# EAGLE design mainboard (EAGLE 6.2)
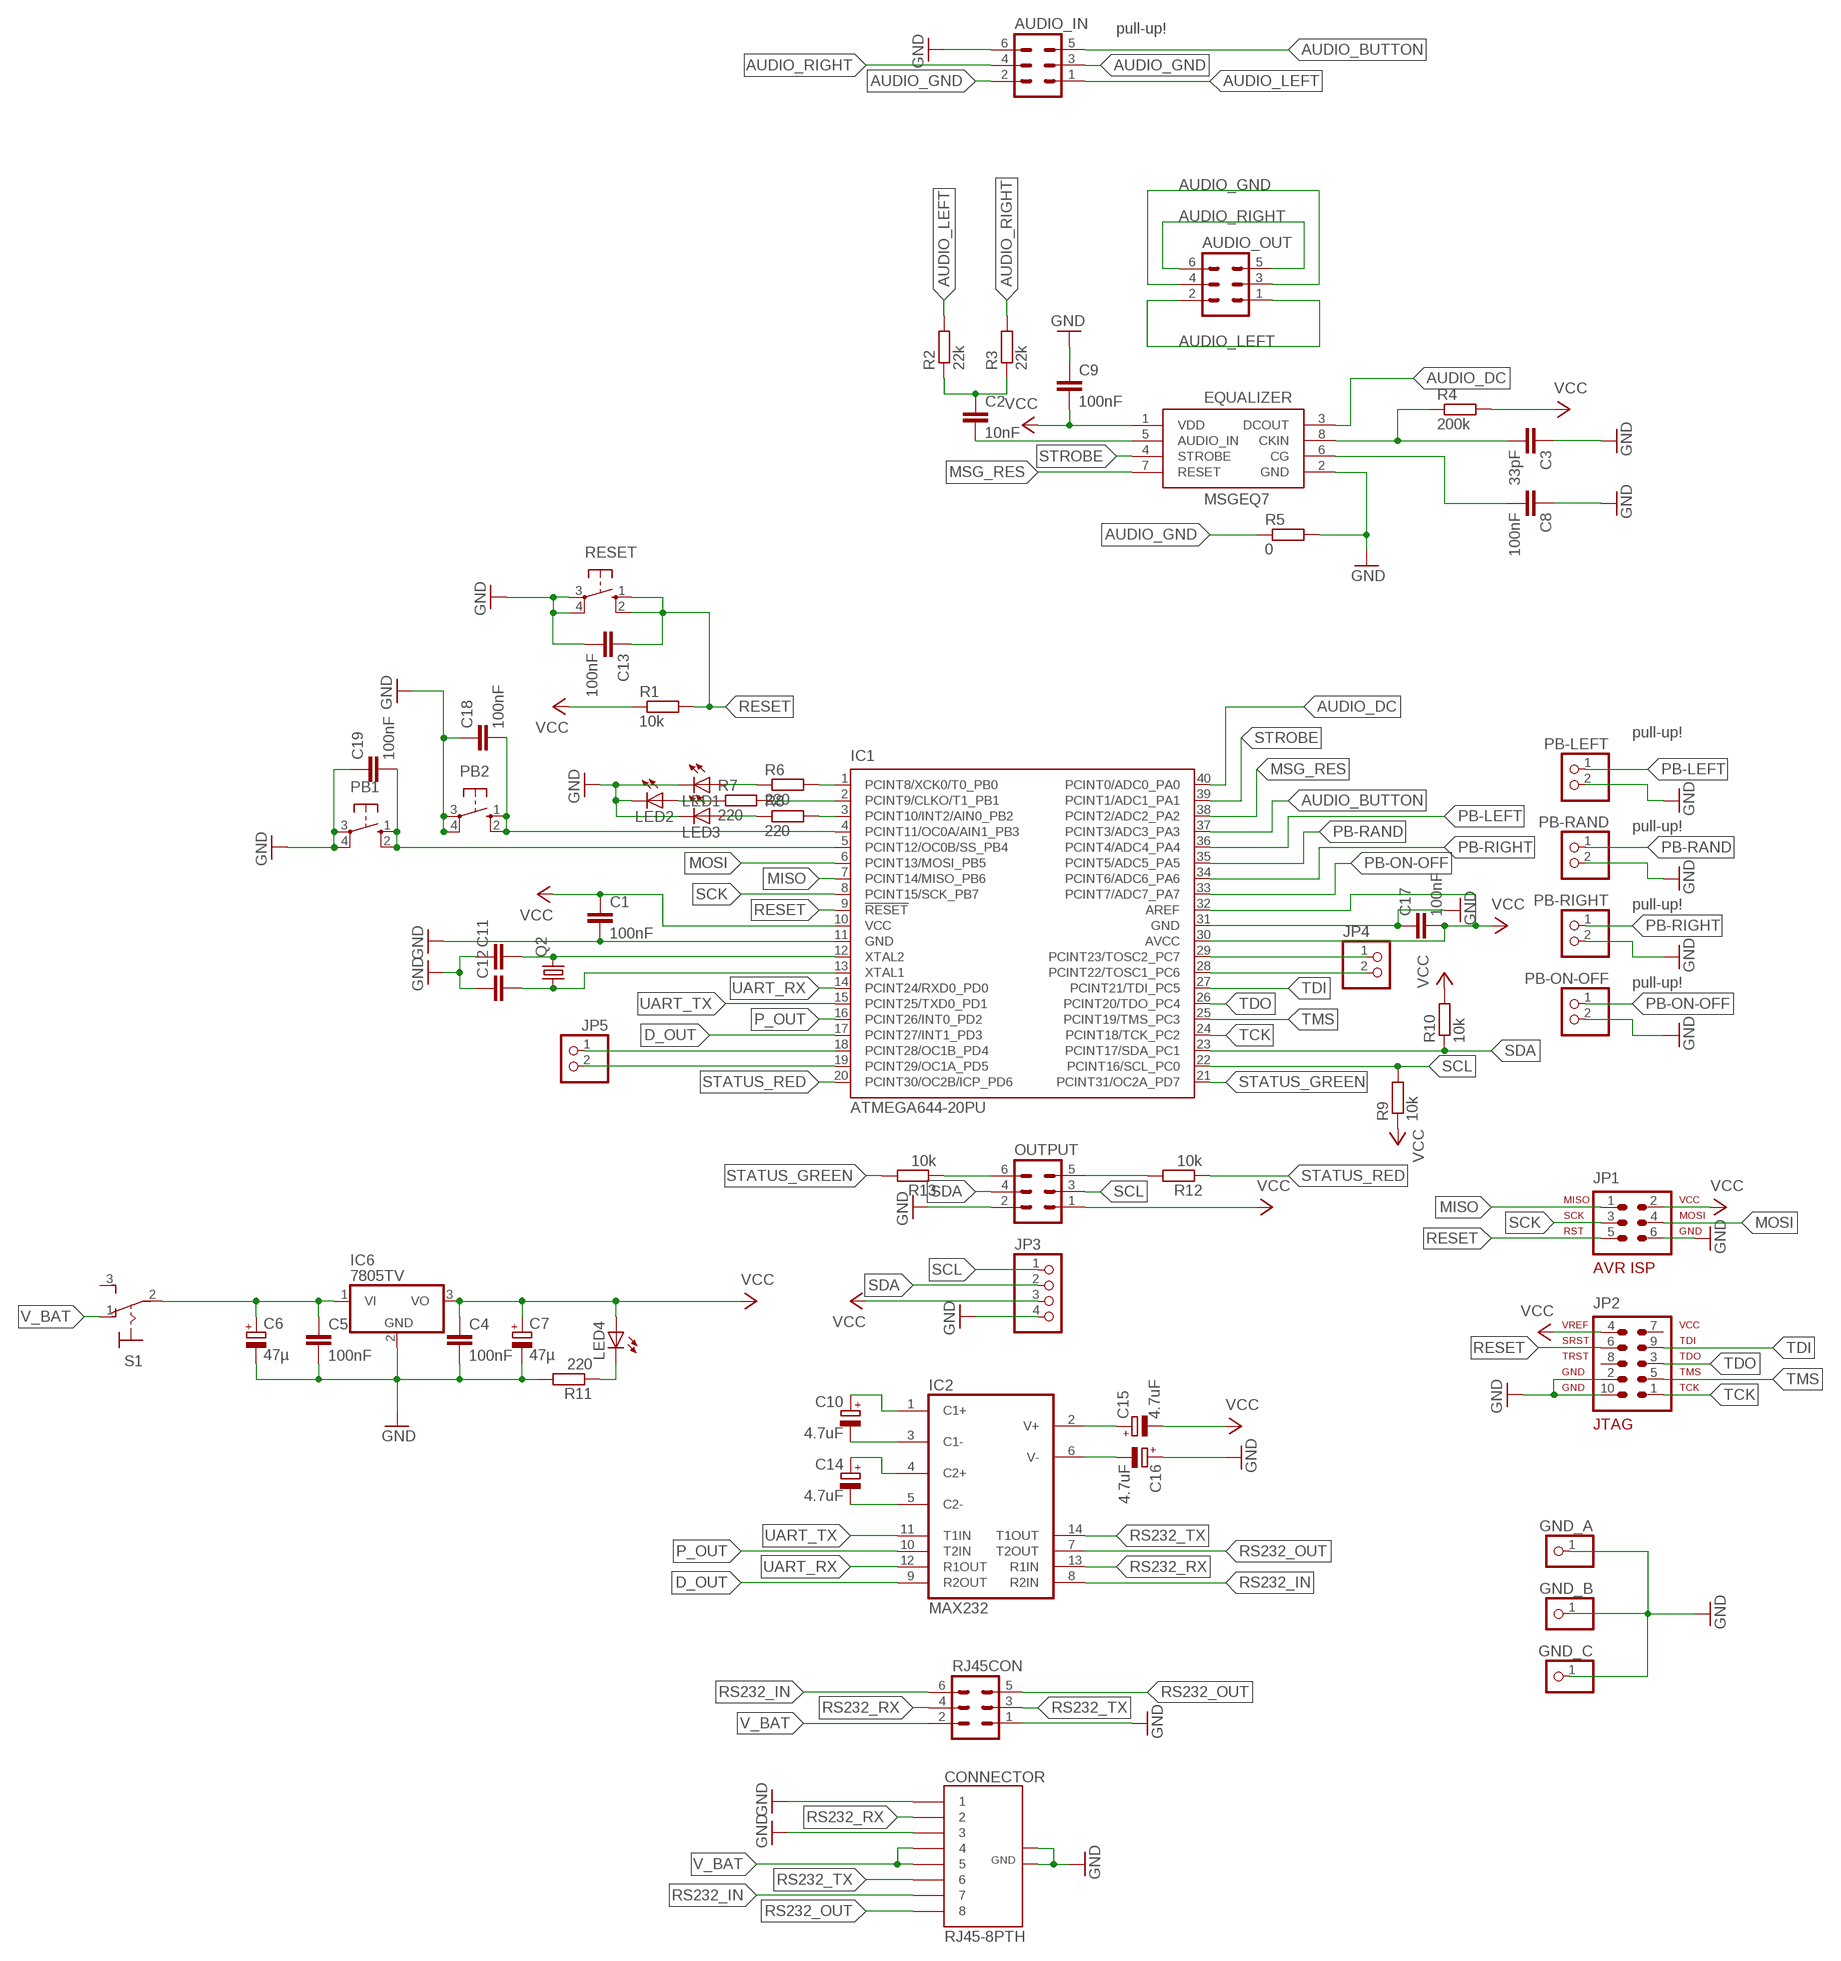
[diagram p0: schematic, sheet 1]

## Parts
AUDIO_IN  ML6  [ML6]
AUDIO_OUT  ML6  [ML6]
C1  100nF  C-EUC1206  [C1206]
C2  10nF  C-EUC1206  [C1206]
C3  33pF  C-EUC1206  [C1206]
C4  100nF  C-EUC1206  [C1206]
C5  100nF  C-EUC1206  [C1206]
C6  47µ  CPOL-EUE2.5-6  [E2,5-6]
C7  47µ  CPOL-EUE2.5-6  [E2,5-6]
C8  100nF  C-EUC1206  [C1206]
C9  100nF  C-EUC1206  [C1206]
C10  4.7uF  CPOL-EUE2-5  [E2-5]
C11  C-EUC1206  [C1206]
C12  C-EUC1206  [C1206]
C13  100nF  C-EUC1206  [C1206]
C14  4.7uF  CPOL-EUE2-5  [E2-5]
C15  4.7uF  CPOL-EUE2-5  [E2-5]
C16  4.7uF  CPOL-EUE2-5  [E2-5]
C17  100nF  C-EUC1206  [C1206]
C18  100nF  C-EUC1206  [C1206]
C19  100nF  C-EUC1206  [C1206]
CONNECTOR  RJ45-8PTH  [RJ45-8]
EQUALIZER  MSGEQ7  [DIL-08]
GND_A  PINHD-1X1  [1X01]
GND_B  PINHD-1X1  [1X01]
GND_C  PINHD-1X1  [1X01]
IC1  ATMEGA644-20PU  [DIL40]
IC2  MAX232  [DIL16]
IC6  7805TV  [TO220V]
JP1  AVR-ISP-6VERT  [AVR-ISP-6]
JP2  AVR-JTAG-10  [AVR-JTAG-10]
JP3  PINHD-1X4  [1X04]
JP4  PINHD-1X2  [1X02]
JP5  PINHD-1X2  [1X02]
LED1  LED5MM  [LED5MM]
LED2  LED5MM  [LED5MM]
LED3  LED5MM  [LED5MM]
LED4  LED5MM  [LED5MM]
OUTPUT  ML6  [ML6]
PB1  10-XX  [B3F-10XX]
PB2  10-XX  [B3F-10XX]
PB-LEFT  PINHD-1X2  [1X02]
PB-ON-OFF  PINHD-1X2  [1X02]
PB-RAND  PINHD-1X2  [1X02]
PB-RIGHT  PINHD-1X2  [1X02]
Q2  CRYSTALHC49S  [HC49/S]
R1  10k  R-EU_0207/10  [0207/10]
R2  22k  R-EU_0207/10  [0207/10]
R3  22k  R-EU_0207/10  [0207/10]
R4  200k  R-EU_0207/10  [0207/10]
R5  0  R-EU_M1206  [M1206]
R6  220  R-EU_0207/10  [0207/10]
R7  220  R-EU_0207/10  [0207/10]
R8  220  R-EU_0207/10  [0207/10]
R9  10k  R-EU_0207/10  [0207/10]
R10  10k  R-EU_0207/12  [0207/12]
R11  220  R-EU_0207/10  [0207/10]
R12  10k  R-EU_0207/15  [0207/15]
R13  10k  R-EU_0207/12  [0207/12]
RESET  10-XX  [B3F-10XX]
RJ45CON  ML6  [ML6]
S1  M9040P  [M9040P]

## Nets
AUDIO_BUTTON: AUDIO_IN.5 IC1.37(PCINT3/ADC3_PA3)
AUDIO_DC: EQUALIZER.3(DCOUT) IC1.40(PCINT0/ADC0_PA0)
AUDIO_GND: AUDIO_IN.2 AUDIO_IN.3 AUDIO_OUT.3 AUDIO_OUT.4 R5.1
AUDIO_LEFT: AUDIO_IN.1 AUDIO_OUT.1 AUDIO_OUT.2 R2.2
AUDIO_RIGHT: AUDIO_IN.4 AUDIO_OUT.5 AUDIO_OUT.6 R3.2
D_OUT: IC1.17(PCINT27/INT1_PD3) IC2.9(R2OUT)
FJKSABFJSD: C5.1 C6.+ IC6.1(VI) S1.2(P)
GND: AUDIO_IN.6 C1.2 C3.1 C4.2 C5.2 C6.- C7.- C8.1 C9.1 C11.1 C12.1 C13.2 C16.+ C17.1 C18.1 C19.1 CONNECTOR.1 CONNECTOR.3 CONNECTOR.GND_1 CONNECTOR.GND_2 EQUALIZER.2(GND) GND_A.1 GND_B.1 GND_C.1 IC1.11(GND) IC1.31(GND) IC6.2(GND) JP1.6 JP2.2 JP2.10 JP3.4 LED1.K(C) LED2.K(C) LED3.K(C) OUTPUT.2 PB1.3(P) PB1.4(P1) PB2.3(P) PB2.4(P1) PB-LEFT.2 PB-ON-OFF.2 PB-RAND.2 PB-RIGHT.2 R5.2 R11.2 RESET.3(P) RESET.4(P1) RJ45CON.1
MISO: IC1.7(PCINT14/MISO_PB6) JP1.1
MOSI: IC1.6(PCINT13/MOSI_PB5) JP1.4
MSG_RES: EQUALIZER.7(RESET) IC1.38(PCINT2/ADC2_PA2)
N$1: C2.2 EQUALIZER.5(AUDIO_IN)
N$2: C2.1 R2.1 R3.1
N$3: C3.2 EQUALIZER.8(CKIN) R4.1
N$4: C14.+ IC2.4(C2+)
N$5: C8.2 EQUALIZER.6(CG)
N$6: C14.- IC2.5(C2-)
N$7: C10.- IC2.3(C1-)
N$8: C10.+ IC2.1(C1+)
N$9: C16.- IC2.6(V-)
N$10: C15.+ IC2.2(V+)
N$11: LED1.A R6.1
N$12: IC1.1(PCINT8/XCK0/T0_PB0) R6.2
N$13: IC1.2(PCINT9/CLKO/T1_PB1) R7.2
N$14: LED2.A R7.1
N$15: IC1.3(PCINT10/INT2/AIN0_PB2) R8.2
N$16: C11.2 IC1.12(XTAL2) Q2.2
N$17: C12.2 IC1.13(XTAL1) Q2.1
N$18: LED3.A R8.1
N$19: LED4.K(C) R11.1
N$20: C18.2 IC1.4(PCINT11/OC0A/AIN1_PB3) PB2.1(S) PB2.2(S1)
N$21: IC1.28(PCINT22/TOSC1_PC6) JP4.2
N$22: IC1.29(PCINT23/TOSC2_PC7) JP4.1
N$23: OUTPUT.5 R12.2
N$24: C19.2 IC1.5(PCINT12/OC0B/SS_PB4) PB1.1(S) PB1.2(S1)
N$25: OUTPUT.6 R13.1
N$26: IC1.18(PCINT28/OC1B_PD4) JP5.1
N$27: IC1.19(PCINT29/OC1A_PD5) JP5.2
P_OUT: IC1.16(PCINT26/INT0_PD2) IC2.10(T2IN)
PB-LEFT: IC1.36(PCINT4/ADC4_PA4) PB-LEFT.1
PB-ON-OFF: IC1.33(PCINT7/ADC7_PA7) PB-ON-OFF.1
PB-RAND: IC1.35(PCINT5/ADC5_PA5) PB-RAND.1
PB-RIGHT: IC1.34(PCINT6/ADC6_PA6) PB-RIGHT.1
RESET: C13.1 IC1.9(!RESET) JP1.5 JP2.6 R1.2 RESET.1(S) RESET.2(S1)
RS232_IN: CONNECTOR.7 IC2.8(R2IN) RJ45CON.6
RS232_OUT: CONNECTOR.8 IC2.7(T2OUT) RJ45CON.5
RS232_RX: CONNECTOR.2 IC2.13(R1IN) RJ45CON.4
RS232_TX: CONNECTOR.6 IC2.14(T1OUT) RJ45CON.3
SCK: IC1.8(PCINT15/SCK_PB7) JP1.3
SCL: IC1.22(PCINT16/SCL_PC0) JP3.1 OUTPUT.3 R9.2
SDA: IC1.23(PCINT17/SDA_PC1) JP3.2 OUTPUT.4 R10.1
STATUS_GREEN: IC1.21(PCINT31/OC2A_PD7) R13.2
STATUS_RED: IC1.20(PCINT30/OC2B/ICP_PD6) R12.1
STROBE: EQUALIZER.4(STROBE) IC1.39(PCINT1/ADC1_PA1)
TCK: IC1.24(PCINT18/TCK_PC2) JP2.1
TDI: IC1.27(PCINT21/TDI_PC5) JP2.9
TDO: IC1.26(PCINT20/TDO_PC4) JP2.3
TMS: IC1.25(PCINT19/TMS_PC3) JP2.5
UART_RX: IC1.14(PCINT24/RXD0_PD0) IC2.12(R1OUT)
UART_TX: IC1.15(PCINT25/TXD0_PD1) IC2.11(T1IN)
V_BAT: CONNECTOR.4 CONNECTOR.5 RJ45CON.2 S1.1(O)
VCC: C1.1 C4.1 C7.+ C9.2 C15.- C17.2 EQUALIZER.1(VDD) IC1.10(VCC) IC1.30(AVCC) IC1.32(AREF) IC6.3(VO) JP1.2 JP2.4 JP3.3 LED4.A OUTPUT.1 R1.1 R4.2 R9.1 R10.2
Unconnected: JP2.7 JP2.8 S1.3(S)

## Notes on the sheet
- pull-up!
- pull-up!
- pull-up!
- pull-up!
- pull-up!

## Power pins joined to a net without a drawn wire
GND: IC2.15(GND)
VCC: IC2.16(VCC)

## Library data of the parts
AUDIO_IN AUDIO_OUT OUTPUT RJ45CON = con-ml:ML6: HARTING; OC_FARNELL: unknown; OC_NEWARK: unknown
C1-C5 C8 C9 C11-C13 C17-C19 = resistor:C-EU: CAPACITOR, European symbol
C6 C7 C10 C14-C16 = resistor:CPOL-EU: POLARIZED CAPACITOR, European symbol
CONNECTOR = ShortCircuitRobotics:RJ45-8: RJ45 Jack Simple RJ45, 8-pin connection - connector for common Cat5, Cat5e, and Cat6 Ethernet cables. Footprint not yet proven in production. Connector sku is PRT-00643; Breakout PCB sku is BOB-00716.
EQUALIZER = SparkFun:MSGEQ7
GND_A GND_B GND_C = pinhead:PINHD-1X1: PIN HEADER
IC1 = atmel:ATMEGA644-*PU: 8-bit Microcontroller with 64K Bytes In-System Programmable Flash Auto generated by make-symbol-device-package-bsdl.ulp Rev. 34 Source: http://www.atmel.com/dyn/resources/prod_documents/doc2593.pdf; MPN: ATMEGA644-20PU; OC_FARNELL: 1288340; OC_NEWARK: 23M5060
IC2 = maxim:MAX232: RS232 TRANSEIVER; MF: MAXIM; MPN: MAX232ACPE+; OC_FARNELL: 9723773; OC_NEWARK: 68K4544
IC6 = linear:78*: Positive VOLTAGE REGULATOR Source: http://cache.national.com/ds/LM/LM78L05.pdf http://www.fairchildsemi.com/ds/LM/LM7805.pdf
JP1 = avr-7:AVR-ISP-6: AVR ISP-6 Serial Programming Header
JP2 = avr-7:AVR-JTAG-10: AVR JTAG Debug/Programming Header
JP3 = pinhead:PINHD-1X4: PIN HEADER
JP4 JP5 PB-LEFT PB-ON-OFF PB-RAND PB-RIGHT = pinhead:PINHD-1X2: PIN HEADER
LED1-LED4 = led:LED: LED OSRAM: - CHIPLED LG R971, LG N971, LY N971, LG Q971, LY Q971, LO R971, LY R971 LH N974, LH R974 LS Q976, LO Q976, LY Q976 LO Q996 - Hyper CHIPLED LW Q18S LB Q993, LB Q99A, LB R99A - SideLED LS A670, LO A670, LY A670, LG A670, LP A670 LB A673, LV A673, LT A673, LW A673 LH A674 LY A675 LS A676, LA A676, LO A676, LY A676, LW A676 LS A679, LY A679, LG A679 - Hyper Micro SIDELED® LS Y876, LA Y876, LO Y876, LY Y876 LT Y87S - SmartLED LW L88C, LW L88S LB L89C, LB L89S, LG L890 LS L89K, LO L89K, LY L89K LS L896, LA L896, LO L896, LY L896 - TOPLED LS T670, LO T670, LY T670, LG T670, LP T670 LSG T670, LSP T670, LSY T670, LOP T670, LYG T670 LG T671, LOG T671, LSG T671 LB T673, LV T673, LT T673, LW T673 LH T674 LS T676, LA T676, LO T676, LY T676, LB T676, LH T676, LSB T676, LW T676 LB T67C, LV T67C, LT T67C, LS T67K, LO T67K, LY T67K, LW E67C LS E67B, LA E67B, LO E67B, LY E67B, LB E67C, LV E67C, LT E67C LW T67C LS T679, LY T679, LG T679 LS T770, LO T770, LY T770, LG T770, LP T770 LB T773, LV T773, LT T773, LW T773 LH T774 LS E675, LA E675, LY E675, LS T675 LS T776, LA T776, LO T776, LY T776, LB T776 LHGB T686 LT T68C, LB T68C - Hyper Mini TOPLED® LB M676 - Mini TOPLED Santana® LG M470 LS M47K, LO M47K, LY M47K Source: http://www.osram.convergy.de LUXEON: - LUMILED® LXK2-PW12-R00, LXK2-PW12-S00, LXK2-PW14-U00, LXK2-PW14-V00 LXK2-PM12-R00, LXK2-PM12-S00, LXK2-PM14-U00 LXK2-PE12-Q00, LXK2-PE12-R00, LXK2-PE12-S00, LXK2-PE14-T00, LXK2-PE14-U00 LXK2-PB12-K00, LXK2-PB12-L00, LXK2-PB12-M00, LXK2-PB14-N00, LXK2-PB14-P00, LXK2-PB14-Q00 LXK2-PR12-L00, LXK2-PR12-M00, LXK2-PR14-Q00, LXK2-PR14-R00 LXK2-PD12-Q00, LXK2-PD12-R00, LXK2-PD12-S00 LXK2-PH12-R00, LXK2-PH12-S00 LXK2-PL12-P00, LXK2-PL12-Q00, LXK2-PL12-R00 Source: www.luxeon.com KINGBRIGHT: KA-3528ASYC Source: www.kingbright.com
PB1 PB2 RESET = switch-omron:10-XX: OMRON SWITCH; MPN: B3F-1000; OC_FARNELL: 176432; OC_NEWARK: 36M3542
Q2 = crystal:CRYSTAL: CRYSTAL; OC_FARNELL: 1667008; OC_NEWARK: unknown
R1-R13 = resistor:R-EU_: RESISTOR, European symbol
S1 = switch:M9040P: TOGGLE SWITCH Marquardt

## Board
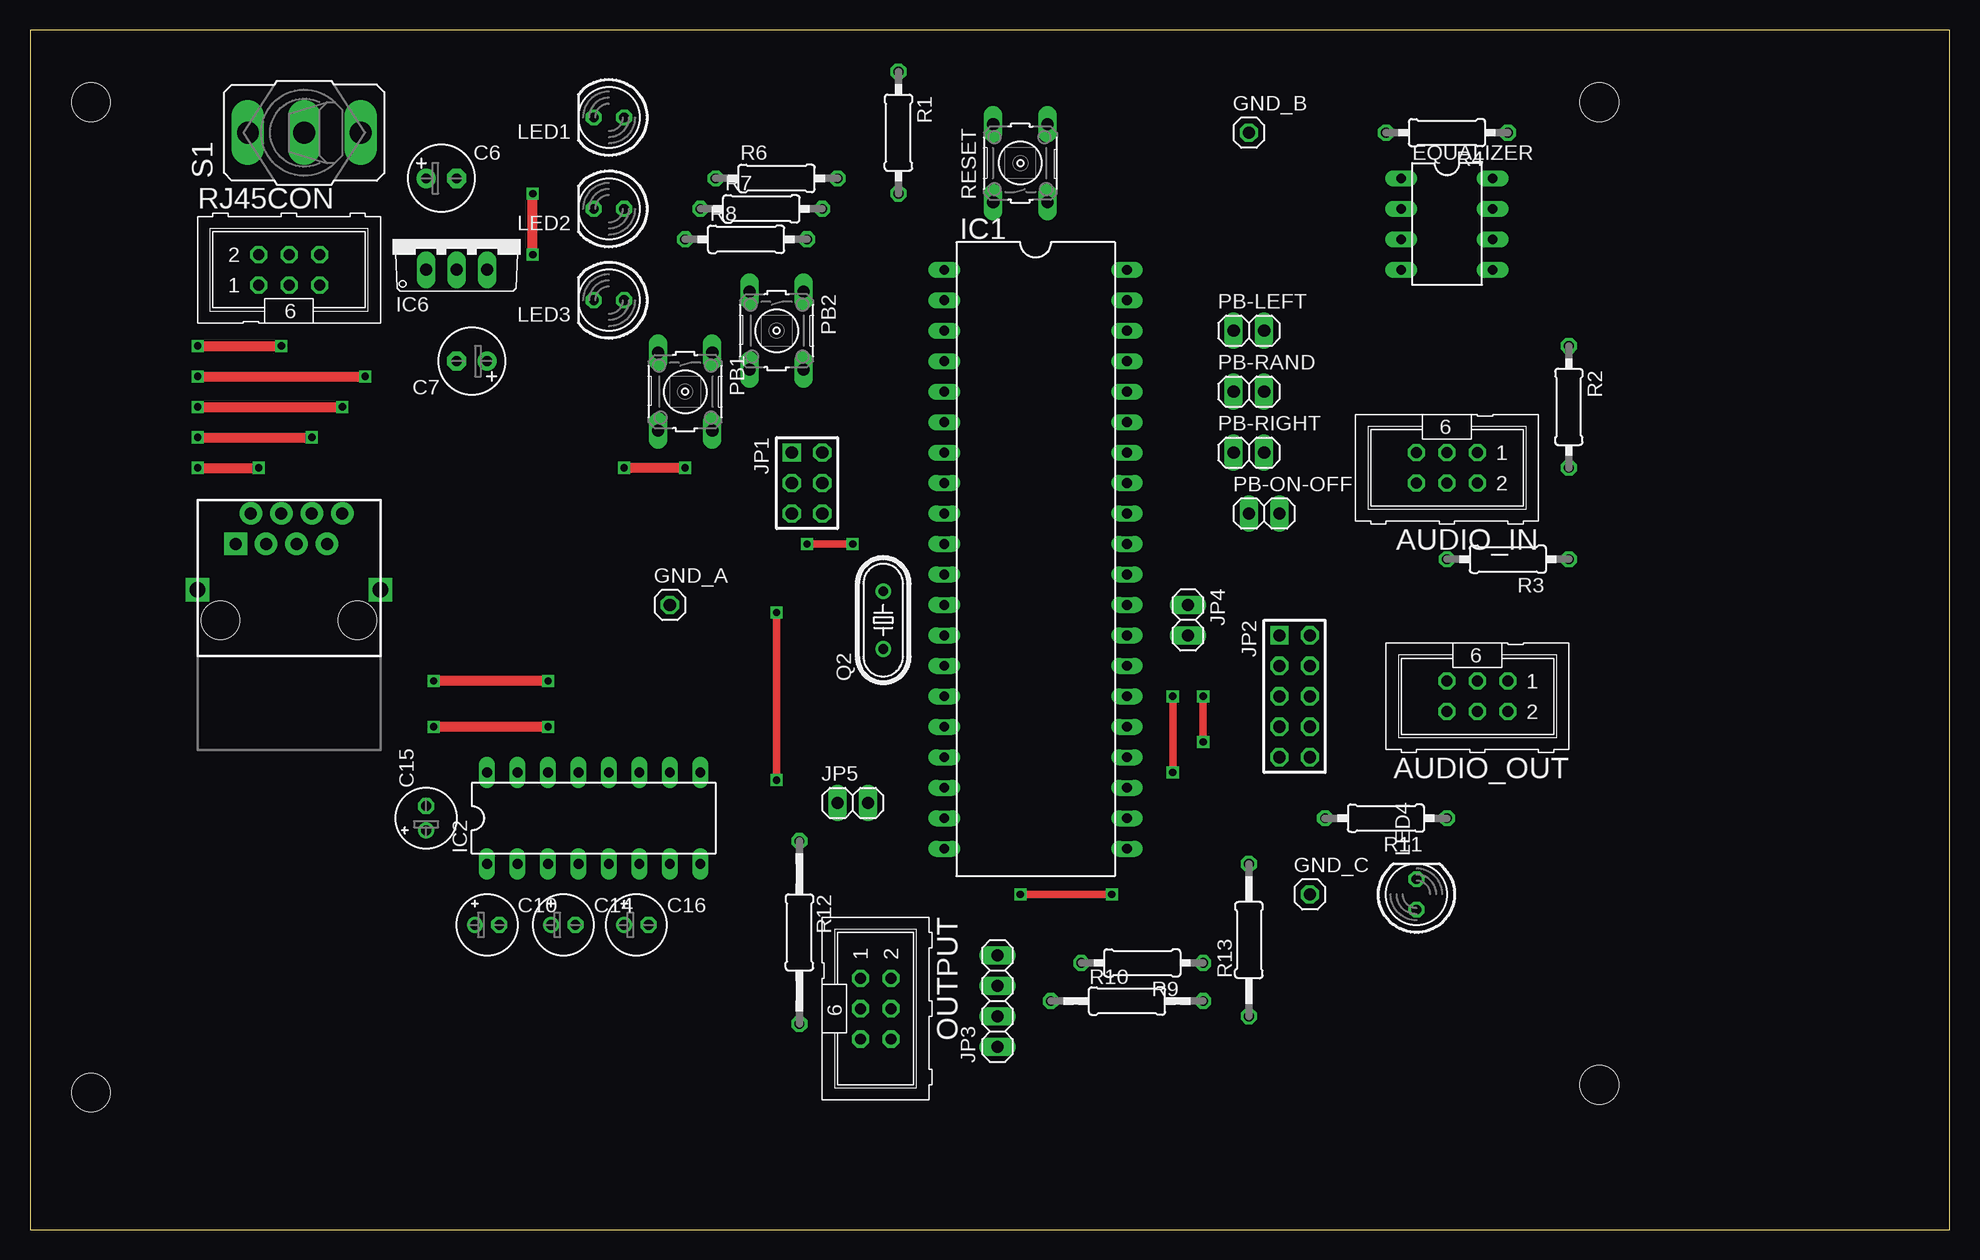
[diagram p1: board, top side]
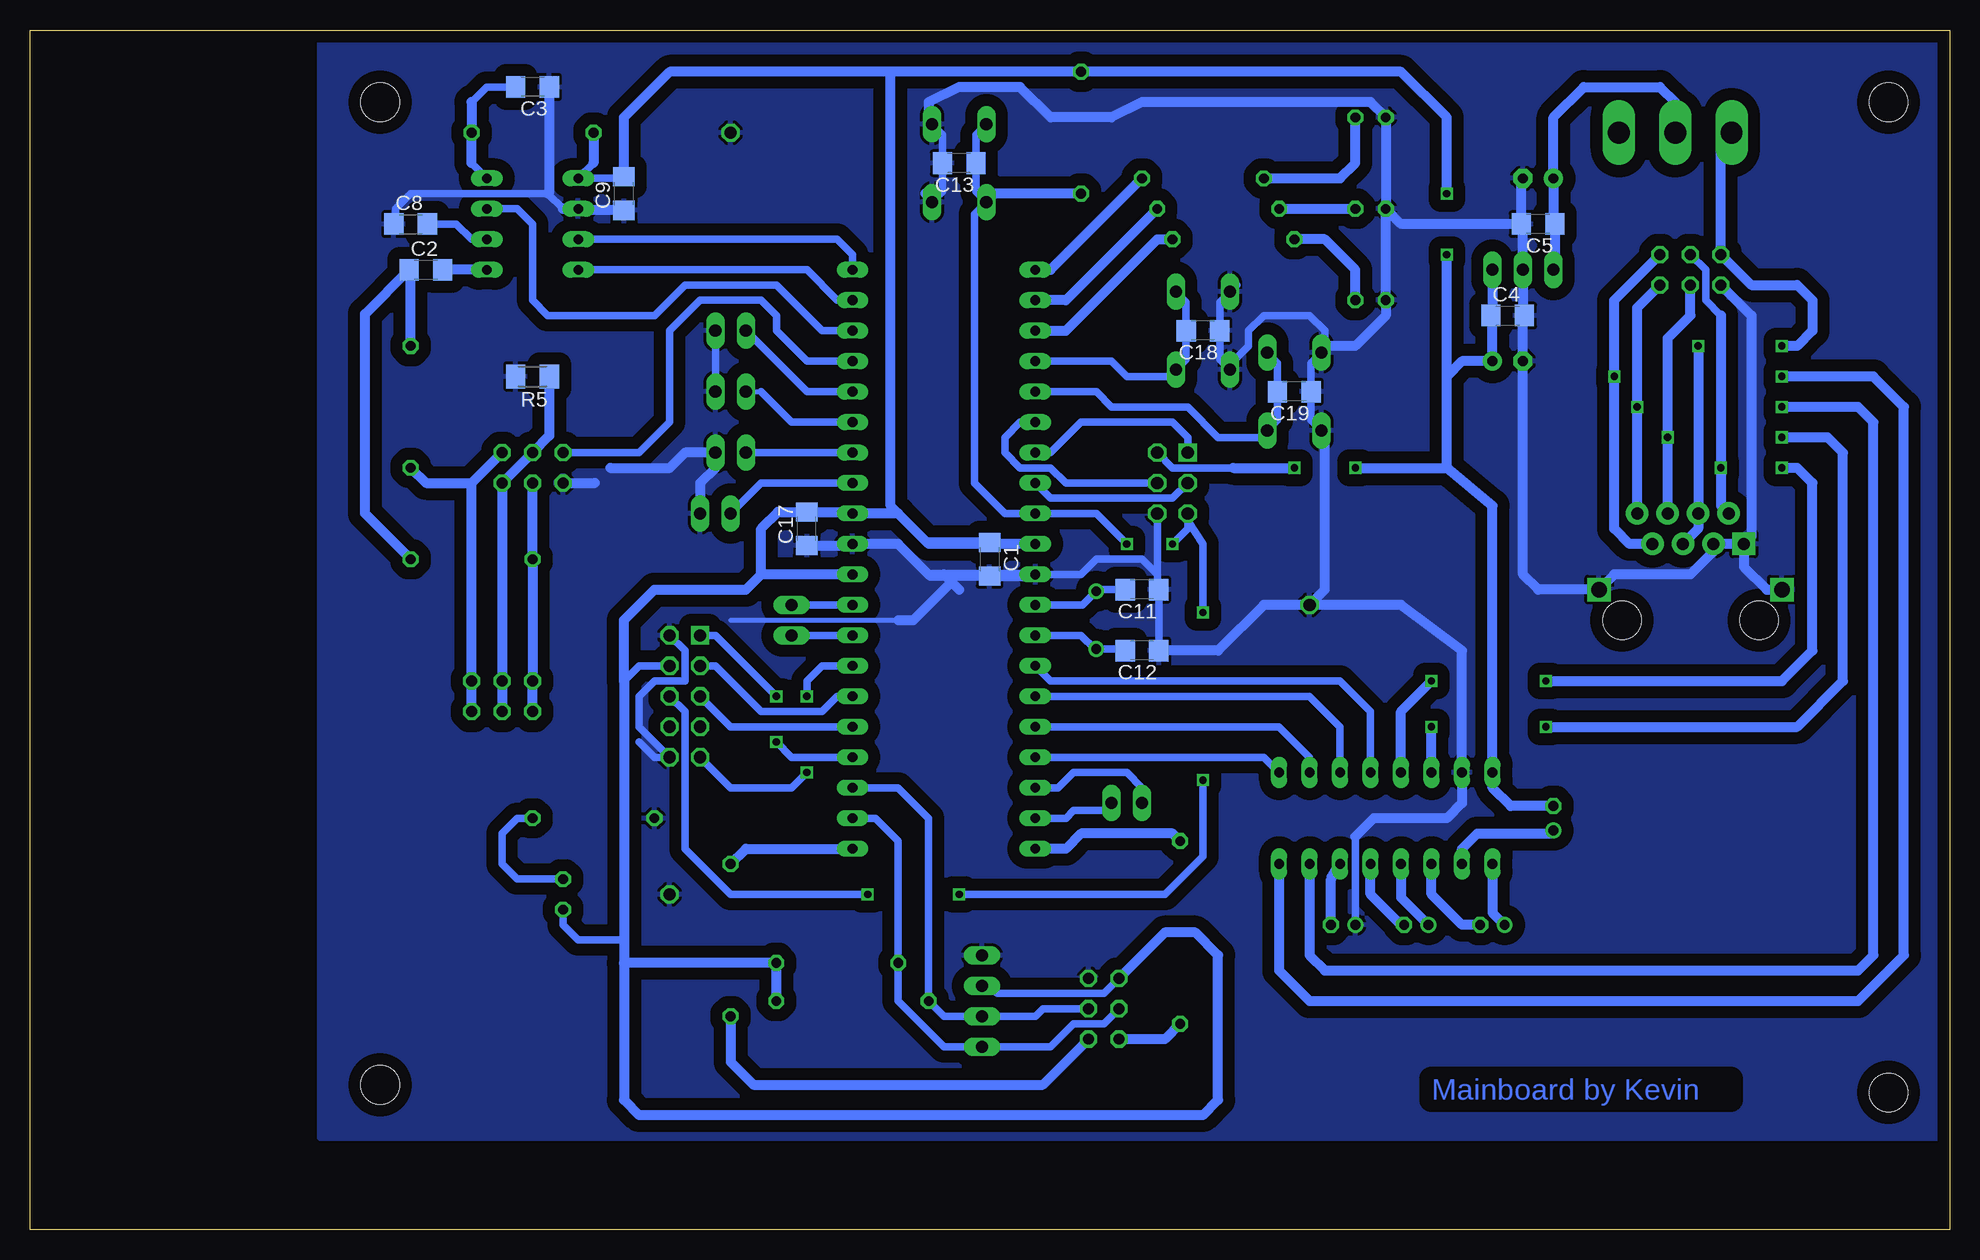
[diagram p2: board, bottom side, seen from below]

Size 160 x 100 mm. Coordinates in mm from the lower left corner, seen from the top.
Outline: 0,0 160,0 160,100 0,100 0,0
Copper layers (1*16): Top 0.035mm / dielectric 1.5mm / Bottom 0.035mm
Design rules: minimum track width 10mil, minimum drill 24mil, track to track 8mil, track to pad 8mil, pad to pad 8mil, via to via 8mil, smd to smd 8mil, copper to edge 40mil, drill to drill 8mil, minimum pad ring 10mil, minimum via ring 8mil, stop-mask expansion 4mil, vias tented up to drill 0mil, thermal gap 10mil
Holes 3.2 mm at 5.08,11.43 5.08,93.98 130.81,12.06 130.81,93.98

### Footprints (pad centres in the part's own frame; a part is rotated, then mirrored left to right if it is on the bottom)
ML6 = drill 0.914 octagon: 1 -2.54,-1.27; 2 -2.54,1.27; 3 0,-1.27; 4 0,1.27; 5 2.54,-1.27; 6 2.54,1.27
C1206 = smd 1.6 x 1.8: 1 -1.4,0; 2 1.4,0
E2,5-6 = drill 0.813 pad 1.6: + -1.27,0 | drill 0.813 pad 1.6 octagon: - 1.27,0
E2-5 = drill 0.813 pad 1.27: + -1.016,0 | drill 0.813 pad 1.27 octagon: - 1.016,0
RJ45-8 = drill 1 pad 1.88 square: 1 -4.445,6.35 | drill 1 pad 1.88: 2 -3.175,8.89; 3 -1.905,6.35; 4 -0.635,8.89; 5 0.635,6.35; 6 1.905,8.89; 7 3.175,6.35; 8 4.445,8.89 | drill 1.3 square: GND_1 -7.62,2.54; GND_2 7.62,2.54 | hole 3.2: -5.715,0; 5.715,0
DIL-08 = drill 0.813 long: 1 -3.81,-3.81; 2 -1.27,-3.81; 3 1.27,-3.81; 4 3.81,-3.81; 5 3.81,3.81; 6 1.27,3.81; 7 -1.27,3.81; 8 -3.81,3.81
1X01 = drill 1.016 octagon: 1 0,0
DIL40 = drill 0.813 long: 1 -24.13,-7.62; 2 -21.59,-7.62; 3 -19.05,-7.62; 4 -16.51,-7.62; 5 -13.97,-7.62; 6 -11.43,-7.62; 7 -8.89,-7.62; 8 -6.35,-7.62; 9 -3.81,-7.62; 10 -1.27,-7.62; 11 1.27,-7.62; 12 3.81,-7.62; 13 6.35,-7.62; 14 8.89,-7.62; 15 11.43,-7.62; 16 13.97,-7.62; 17 16.51,-7.62; 18 19.05,-7.62; 19 21.59,-7.62; 20 24.13,-7.62; 21 24.13,7.62; 22 21.59,7.62; 23 19.05,7.62; 24 16.51,7.62; 25 13.97,7.62; 26 11.43,7.62; 27 8.89,7.62; 28 6.35,7.62; 29 3.81,7.62; 30 1.27,7.62; 31 -1.27,7.62; 32 -3.81,7.62; 33 -6.35,7.62; 34 -8.89,7.62; 35 -11.43,7.62; 36 -13.97,7.62; 37 -16.51,7.62; 38 -19.05,7.62; 39 -21.59,7.62; 40 -24.13,7.62
DIL16 = drill 0.813 long: 1 -8.89,-3.81; 2 -6.35,-3.81; 3 -3.81,-3.81; 4 -1.27,-3.81; 5 1.27,-3.81; 6 3.81,-3.81; 7 6.35,-3.81; 8 8.89,-3.81; 9 8.89,3.81; 10 6.35,3.81; 11 3.81,3.81; 12 1.27,3.81; 13 -1.27,3.81; 14 -3.81,3.81; 15 -6.35,3.81; 16 -8.89,3.81
TO220V = drill 1.016 long: 1 -2.54,-2.54; 2 0,-2.54; 3 2.54,-2.54
AVR-ISP-6 = drill 1.016 square: 1 -2.54,-1.27 | drill 1.016 octagon: 2 -2.54,1.27; 3 0,-1.27; 4 0,1.27; 5 2.54,-1.27; 6 2.54,1.27
AVR-JTAG-10 = drill 1.016 square: 1 -5.08,-1.27 | drill 1.016 octagon: 2 -5.08,1.27; 3 -2.54,-1.27; 4 -2.54,1.27; 5 0,-1.27; 6 0,1.27; 7 2.54,-1.27; 8 2.54,1.27; 9 5.08,-1.27; 10 5.08,1.27
1X04 = drill 1.016 long: 1 -3.81,0; 2 -1.27,0; 3 1.27,0; 4 3.81,0
1X02 = drill 1.016 long: 1 -1.27,0; 2 1.27,0
LED5MM = drill 0.813 octagon: A -1.27,0; K 1.27,0
B3F-10XX = drill 1.016 long: 1 -3.251,2.261; 2 3.251,2.261; 3 -3.251,-2.261; 4 3.251,-2.261
HC49/S = drill 0.813: 1 -2.413,0; 2 2.413,0
0207/10 = drill 0.813 octagon: 1 -5.08,0; 2 5.08,0
M1206 = smd 1.6 x 2: 1 -1.4,0; 2 1.4,0
0207/12 = drill 0.813 octagon: 1 -6.35,0; 2 6.35,0
0207/15 = drill 0.813 octagon: 1 -7.62,0; 2 7.62,0
M9040P = drill 1.803 long: 1 0,4.699; 2 0,0; 3 0,-4.699

### Placement (x,y rotation side)
AUDIO_IN  118.11,63.5 180 top
AUDIO_OUT  120.65,44.45 180 top
C1  80.01,55.88 270 bottom
C2  127,80.01 0 bottom
C3  118.11,95.25 180 bottom
C4  36.83,76.2 0 bottom
C5  34.29,83.82 180 bottom
C6  34.29,87.63 0 top
C7  36.83,72.39 180 top
C8  128.27,83.82 0 bottom
C9  110.49,86.36 90 bottom
C10  38.1,25.4 0 top
C11  67.31,53.34 180 bottom
C12  67.31,48.26 180 bottom
C13  82.55,88.9 180 bottom
C14  44.45,25.4 0 top
C15  33.02,34.29 90 top
C16  50.55,25.4 0 top
C17  95.25,58.42 90 bottom
C18  62.23,74.93 180 bottom
C19  54.61,69.85 180 bottom
CONNECTOR  21.59,50.8 0 top
EQUALIZER  118.11,83.82 270 top
GND_A  53.34,52.07 0 top
GND_B  101.6,91.44 0 top
GND_C  106.68,27.94 0 top
IC1  83.82,55.88 270 top
IC2  46.99,34.29 0 top
IC6  35.56,82.55 0 top
JP1  64.77,62.23 270 top
JP2  105.41,44.45 270 top
JP3  80.64,19.05 90 top
JP4  96.52,50.8 270 top
JP5  68.58,35.56 0 top
LED1  48.26,92.71 180 top
LED2  48.26,85.09 180 top
LED3  48.26,77.47 180 top
LED4  115.57,27.94 90 top
OUTPUT  70.48,18.41 270 top
PB1  54.61,69.85 270 top
PB2  62.23,74.93 270 top
PB-LEFT  101.6,74.93 0 top
PB-ON-OFF  102.87,59.69 0 top
PB-RAND  101.6,69.85 0 top
PB-RIGHT  101.6,64.77 0 top
Q2  71.12,50.8 90 top
R1  72.39,91.44 270 top
R2  128.27,68.58 270 top
R3  123.19,55.88 180 top
R4  118.11,91.44 180 top
R5  118.11,71.12 180 bottom
R6  62.23,87.63 0 top
R7  60.96,85.09 0 top
R8  59.69,82.55 0 top
R9  92.71,22.23 180 top
R10  91.44,19.05 0 top
R11  113.03,34.29 180 top
R12  64.14,24.77 270 top
R13  101.6,24.13 90 top
RESET  82.55,88.9 90 top
RJ45CON  21.59,80.01 0 top
S1  22.86,91.44 90 top

### Tracks (layer width: path | path; a pad name or v marks a point on that pad's centre or on a via)
AUDIO_BUTTON
  Bottom 0.61: IC1.37 95.25,72.39 97.79,74.93 97.79,76.2 99.06,77.47 104.14,77.47 106.68,74.93 106.68,67.31 109.22,64.77 AUDIO_IN.5
AUDIO_DC
  Bottom 0.61: IC1.40 91.44,81.28 92.71,82.55 EQUALIZER.3
AUDIO_GND
  Bottom 0.61: AUDIO_OUT.4 AUDIO_OUT.3
  Bottom 0.813: AUDIO_OUT.4 AUDIO_IN.2 AUDIO_IN.3 116.71,66.17 R5.1
AUDIO_LEFT
  Bottom 0.61: AUDIO_OUT.1 AUDIO_OUT.2
  Bottom 0.813: AUDIO_OUT.2 123.19,62.23 | 123.19,62.23 AUDIO_IN.1 | R2.2 127,62.23 123.19,62.23
AUDIO_RIGHT
  Bottom 0.813: AUDIO_OUT.6 AUDIO_OUT.5 R3.2 AUDIO_IN.4
D_OUT
  Bottom 0.61: IC1.17 57.15,39.37 IC2.9
FJKSABFJSD
  Bottom 0.813: IC6.1 32.89,80.14 C5.1 33.02,83.82 C6.+ 33.02,92.71 30.48,95.25 24.13,95.25 22.86,93.98 S1.2
GND
  Bottom 0.406: 91.44,57.02 IC1.31 | 101.6,50.8 87.63,50.8 | 66.04,54.61 66.04,48.26 60.96,48.26
  Bottom 0.61: JP1.6 66.04,54.61 | 66.04,54.61 66.04,53.47 C11.1 C12.1 | 66.04,54.61 67.31,55.88 71.12,55.88 72.39,54.61 IC1.11 76.33,54.48 | PB-LEFT.2 PB-RAND.2 | 114.17,84.96 EQUALIZER.2 | 115.57,85.09 116.84,86.36 128.27,86.36 129.54,85.09 129.54,83.82 C8.1 | PB1.4 53.21,67.46 C19.1 53.21,72.24 PB1.3 52.07,73.38 52.07,74.93 53.34,76.2 57.15,76.2 58.42,74.93 58.42,73.66 59.97,72.11 PB2.4 60.83,72.54 C18.1 60.83,77.32 PB2.3 59.41,78.74 | RESET.4 83.95,91.29 C13.2 83.95,86.51 RESET.3 | C16.+ 49.53,32.77 | JP2.2 105.41,48.26 105.41,45.72 107.95,45.72 109.22,44.45 109.22,41.91 JP2.10 107.95,39.37 109.22,40.64
  Bottom 0.813: 76.33,54.48 C1.2 84.96,54.48 85.09,54.61 | IC1.31 87.63,57.15 85.09,54.61 | C17.1 91.44,57.02 | 82.55,53.34 83.19,53.98 | 83.19,53.98 83.82,54.61 | C9.1 114.17,84.96 | AUDIO_IN.6 112.9,62.23 | EQUALIZER.2 115.57,85.09 | 87.63,50.8 86.36,50.8 83.19,53.98 | 85.09,54.61 83.82,54.61 | 85.37,86.36 RESET.3 | C3.1 116.71,86.49 116.84,86.36 | LED2.K LED1.K 48.26,93.98 67.31,93.98 69.85,92.71 74.93,92.71 77.47,95.25 82.55,95.25 85.09,93.98 85.09,92.43 RESET.4 | PB1.3 51.79,73.66 49.53,73.66 46.99,76.2 LED3.K LED2.K | PB-ON-OFF.2 104.14,62.23 102.87,63.5 PB-RIGHT.2 105.41,64.77 106.68,63.5 111.63,63.5 | 49.53,32.77 48.01,34.29 41.91,34.29 40.64,35.56 IC2.15 40.64,48.26 45.72,52.07 GND_A.1 | RJ45CON.1 16.51,76.2 16.51,57.78 CONNECTOR.1 | GND_A.1 57.15,52.07 60.96,48.26 C12.1 66.04,48.26 | C5.2 35.69,87.5 C6.- | C5.2 35.56,83.69 IC6.2 35.56,76.33 C4.2 35.56,76.07 C7.- 35.56,54.61 34.29,53.34 CONNECTOR.GND_2 27.94,54.61 21.59,54.61 19.68,56.52 CONNECTOR.3 CONNECTOR.1 | C5.2 45.72,83.82 LED2.K | CONNECTOR.1 17.14,55.24 15.24,53.34 CONNECTOR.GND_1 | 83.82,54.61 IC1.11 | GND_A.1 52.07,53.34 52.07,66.32 PB1.4
  pour Bottom (isolate 1.016): 0,100.33 135.89,100.33 135.89,7.62 0,7.62
MISO
  Bottom 0.61: JP1.1 63.5,66.04 64.77,67.31 72.39,67.31 74.93,64.77 IC1.7
MOSI
  Bottom 0.61: IC1.6 77.47,67.31 78.74,66.04 78.74,64.77 77.47,63.5 74.93,63.5 73.66,62.23 JP1.4
MSG_RES
  Bottom 0.61: IC1.38 93.98,74.93 97.79,78.74 105.41,78.74 107.95,76.2 116.84,76.2 118.11,77.47 118.11,83.82 119.38,85.09 EQUALIZER.7
N$1
  Bottom 0.813: EQUALIZER.5 C2.2
N$2
  Bottom 0.813: R3.1 132.08,59.69 132.08,76.33 C2.1 128.27,79.88 R2.1
N$3
  Bottom 0.61: EQUALIZER.8 123.19,88.9 | 123.19,93.98 121.92,95.25 C3.2 119.38,95.25
  Bottom 0.813: 123.19,88.9 R4.1 123.19,93.98
N$4
  Bottom 0.813: IC2.4 45.72,27.69 C14.+
N$5
  Bottom 0.61: EQUALIZER.6 123.19,82.55 124.46,83.82 C8.2
N$6
  Bottom 0.813: C14.- 45.72,25.4 48.26,27.94 IC2.5
N$7
  Bottom 0.813: C10.- 40.64,25.4 43.18,27.94 IC2.3
N$8
  Bottom 0.813: IC2.1 38.1,26.42 C10.+
N$9
  Bottom 0.813: C16.- 51.56,29.21 IC2.6
N$10
  Bottom 0.813: IC2.2 40.64,31.75 39.37,33.02 33.27,33.02 C15.+
N$11
  Bottom 0.813: R6.1 50.8,87.63 49.53,88.9 LED1.A
N$12
  Bottom 0.813: IC1.1 74.93,80.01 R6.2
N$13
  Bottom 0.813: R7.2 73.66,77.47 IC1.2
N$14
  Bottom 0.813: R7.1 LED2.A
N$15
  Bottom 0.813: IC1.3 73.66,74.93 66.04,82.55 R8.2
N$16
  Bottom 0.61: 70.99,53.34 Q2.2 | IC1.12 72.26,52.07 Q2.2 | C11.2 71.12,53.34 Q2.2
N$17
  Bottom 0.61: C12.2 68.84,48.39 Q2.1 71.25,48.39 72.39,49.53 IC1.13
N$18
  Bottom 0.813: LED3.A 49.53,80.01 52.07,82.55 R8.1
N$19
  Bottom 0.61: R11.1 119.38,34.29 120.65,33.02 120.65,30.48 119.38,29.21 LED4.K
N$20
  Bottom 0.61: PB2.1 63.63,77.32 C18.2 63.63,72.54 PB2.2 65.05,71.12 68.58,71.12 69.85,72.39 IC1.4
N$21
  Bottom 0.61: JP4.2 IC1.28
N$22
  Bottom 0.61: JP4.1 IC1.29
N$23
  Bottom 0.813: R12.2 65.41,15.88 OUTPUT.5
N$24
  Bottom 0.61: PB1.1 56.01,72.24 C19.2 56.01,67.46 PB1.2 57.43,66.04 60.96,66.04 63.5,68.58 69.85,68.58 71.12,69.85 IC1.5
N$25
  Bottom 0.813: R13.1 101.6,13.97 99.69,12.06 75.56,12.06 OUTPUT.6
N$26
  Bottom 0.61: JP5.1 67.31,36.83 68.58,38.1 73.03,38.1 74.3,36.83 IC1.18
N$27
  Bottom 0.61: IC1.19 73.66,34.29 73.03,34.92 70.48,34.92 JP5.2
P_OUT
  Bottom 0.61: IC1.16 55.88,41.91 53.34,39.37 IC2.10
PB-LEFT
  Bottom 0.61: IC1.36 95.25,69.85 PB-LEFT.1
PB-ON-OFF
  Bottom 0.61: PB-ON-OFF.1 99.06,62.23 IC1.33
PB-RAND
  Bottom 0.406: PB-RAND.1 99.06,69.85
  Bottom 0.61: 99.06,69.85 96.52,67.31 IC1.35
PB-RIGHT
  Bottom 0.61: PB-RIGHT.1 IC1.34
RESET  (via drill 0.6)
  Top 0.61: v68.58,57.15 v64.77,57.15 | v90.17,27.94 v82.55,27.94 | v62.23,37.47 v62.23,51.44
  Bottom 0.61: v68.58,57.15 71.12,59.69 IC1.9 78.74,59.69 81.28,62.23 81.28,84.66 RESET.1 81.15,86.51 C13.1 81.15,91.29 RESET.2 | v64.77,57.15 63.5,58.42 JP1.5 63.5,59.05 62.23,57.15 v62.23,51.44 | v90.17,27.94 101.6,27.94 105.41,31.75 105.41,43.18 JP2.6 | v82.55,27.94 65.41,27.94 62.23,31.11 v62.23,37.47
  Bottom 0.813: 79.73,86.36 79.97,86.06 | 79.97,86.06 RESET.1 | R1.2 79.67,86.36 79.97,86.06
RS232_IN  (via drill 0.6)
  Top 0.813: v13.97,71.12 v27.94,71.12
  Bottom 0.813: RJ45CON.6 27.94,77.47 v27.94,71.12 27.94,58.42 26.67,57.15 CONNECTOR.7 | IC2.8 55.88,21.59 53.34,19.05 7.62,19.05 3.81,22.86 3.81,68.58 6.35,71.12 v13.97,71.12
RS232_OUT  (via drill 0.6)
  Top 0.813: v13.97,68.58 v26.04,68.58
  Bottom 0.813: IC2.7 53.34,22.86 52.07,21.59 7.62,21.59 6.35,22.86 6.35,67.31 7.62,68.58 v13.97,68.58 | CONNECTOR.8 v26.04,68.58 26.04,76.83 RJ45CON.5
RS232_RX  (via drill 0.6)
  Top 0.813: v43.18,45.72 v33.66,45.72 | v13.97,63.5 v19.05,63.5
  Bottom 0.61: RJ45CON.4 20.32,80.01 20.32,77.47 19.05,76.2
  Bottom 0.813: IC2.13 45.72,43.18 v43.18,45.72 | v33.66,45.72 13.97,45.72 11.43,48.26 11.43,62.23 12.7,63.5 v13.97,63.5 | 19.05,76.2 v19.05,63.5 19.05,60.33 CONNECTOR.2
RS232_TX  (via drill 0.6)
  Top 0.813: v43.18,41.91 v33.66,41.91 | v13.97,66.04 v23.5,66.04
  Bottom 0.813: CONNECTOR.6 v23.5,66.04 23.5,74.3 21.59,76.2 RJ45CON.3 | IC2.14 v43.18,41.91 | v33.66,41.91 12.7,41.91 8.89,45.72 8.89,64.77 10.16,66.04 v13.97,66.04
SCK
  Bottom 0.61: JP1.3 64.77,60.96 74.93,60.96 IC1.8
SCL
  Bottom 0.61: IC1.22 89.53,34.29 87.63,32.38 R9.2 87.63,19.05 83.82,15.24 JP3.1 74.93,15.24 73.03,17.14 70.48,17.14 OUTPUT.3
SDA
  Bottom 0.61: IC1.23 87.63,36.83 85.09,34.29 R10.1 83.82,17.78 JP3.2 76.2,17.78 75.56,18.41 OUTPUT.4
STATUS_GREEN
  Bottom 0.813: R13.2 100.33,31.75 IC1.21
STATUS_RED
  Bottom 0.813: R12.1 64.77,33.02 72.39,33.02 73.66,31.75 IC1.20
STROBE
  Bottom 0.61: EQUALIZER.4 95.25,80.01 92.71,77.47 IC1.39
TCK  (via drill 0.6)
  Top 0.61: v97.79,40.64 v97.79,44.45
  Bottom 0.61: IC1.24 96.52,39.37 v97.79,40.64 | v97.79,44.45 102.87,49.53 JP2.1
TDI  (via drill 0.6)
  Top 0.61: v95.25,38.1 v95.25,44.45
  Bottom 0.61: v95.25,44.45 95.25,45.72 93.98,46.99 IC1.27 | JP2.9 101.6,36.83 96.52,36.83 v95.25,38.1
TDO
  Bottom 0.61: JP2.3 102.87,46.99 99.06,43.18 93.98,43.18 92.71,44.45 IC1.26
TMS
  Bottom 0.61: IC1.25 101.6,41.91 JP2.5
UART_RX
  Bottom 0.61: IC1.14 74.93,45.72 50.8,45.72 48.26,43.18 IC2.12
UART_TX
  Bottom 0.61: IC1.15 53.34,44.45 50.8,41.91 IC2.11
V_BAT  (via drill 0.6)
  Top 0.813: v13.97,73.66 v20.95,73.66
  Bottom 0.813: S1.1 19.05,91.82 RJ45CON.2 16.51,78.74 12.7,78.74 11.43,77.47 11.43,74.93 12.7,73.66 v13.97,73.66 | CONNECTOR.5 20.95,58.42 CONNECTOR.4 v20.95,73.66
VCC  (via drill 0.6)
  Top 0.813: v41.91,81.28 v41.91,86.36 | v54.61,63.5 v49.53,63.5
  Bottom 0.406: 91.44,59.82 IC1.32
  Bottom 0.61: IC1.10 80.01,57.15 C1.1 | C9.2 110.49,87.63 EQUALIZER.1 113.03,88.9 | JP1.2 64.77,63.5 59.69,63.5 | JP2.4 109.22,46.99 110.49,45.72 | LED4.A 115.57,25.4 114.3,24.13 110.49,24.13 | JP3.3 79.38,19.68 70.48,19.68 OUTPUT.1
  Bottom 0.813: 91.44,59.82 C17.2 97.66,59.82 99.06,58.42 99.06,54.61 | IC1.30 99.06,54.61 | C1.1 85.22,57.28 | 85.22,57.28 87.63,59.69 | 87.63,59.69 IC1.32 | 99.06,54.61 100.33,53.34 107.95,53.34 110.49,50.8 110.49,45.72 110.49,24.13 110.49,22.23 | 110.49,22.23 110.49,10.79 109.22,9.53 62.23,9.53 60.96,10.79 60.96,22.86 62.87,24.77 65.41,24.77 OUTPUT.1 | 110.49,87.63 110.49,92.71 106.68,96.52 88.27,96.52 | C15.- 36.58,35.31 38.1,36.83 IC2.16 38.1,60.33 41.91,63.5 | 41.91,63.5 41.91,71.12 | 41.91,71.12 v41.91,81.28 | v41.91,86.36 41.91,92.71 45.72,96.52 R1.1 88.27,96.52 | IC6.3 38.1,76.33 C4.1 38.1,76.07 C7.+ 40.64,72.39 41.91,71.12 | 59.69,63.5 v54.61,63.5 | v49.53,63.5 41.91,63.5 | R4.2 113.03,88.9 | IC1.10 85.09,57.15 85.22,57.28 | 87.63,59.69 88.27,60.33 88.27,96.52 | R10.2 R9.1 110.49,22.23

### Text on the board
Bottom: Mainboard by Kevin